# EAGLE design FREENFET (EAGLE 6.5.0)
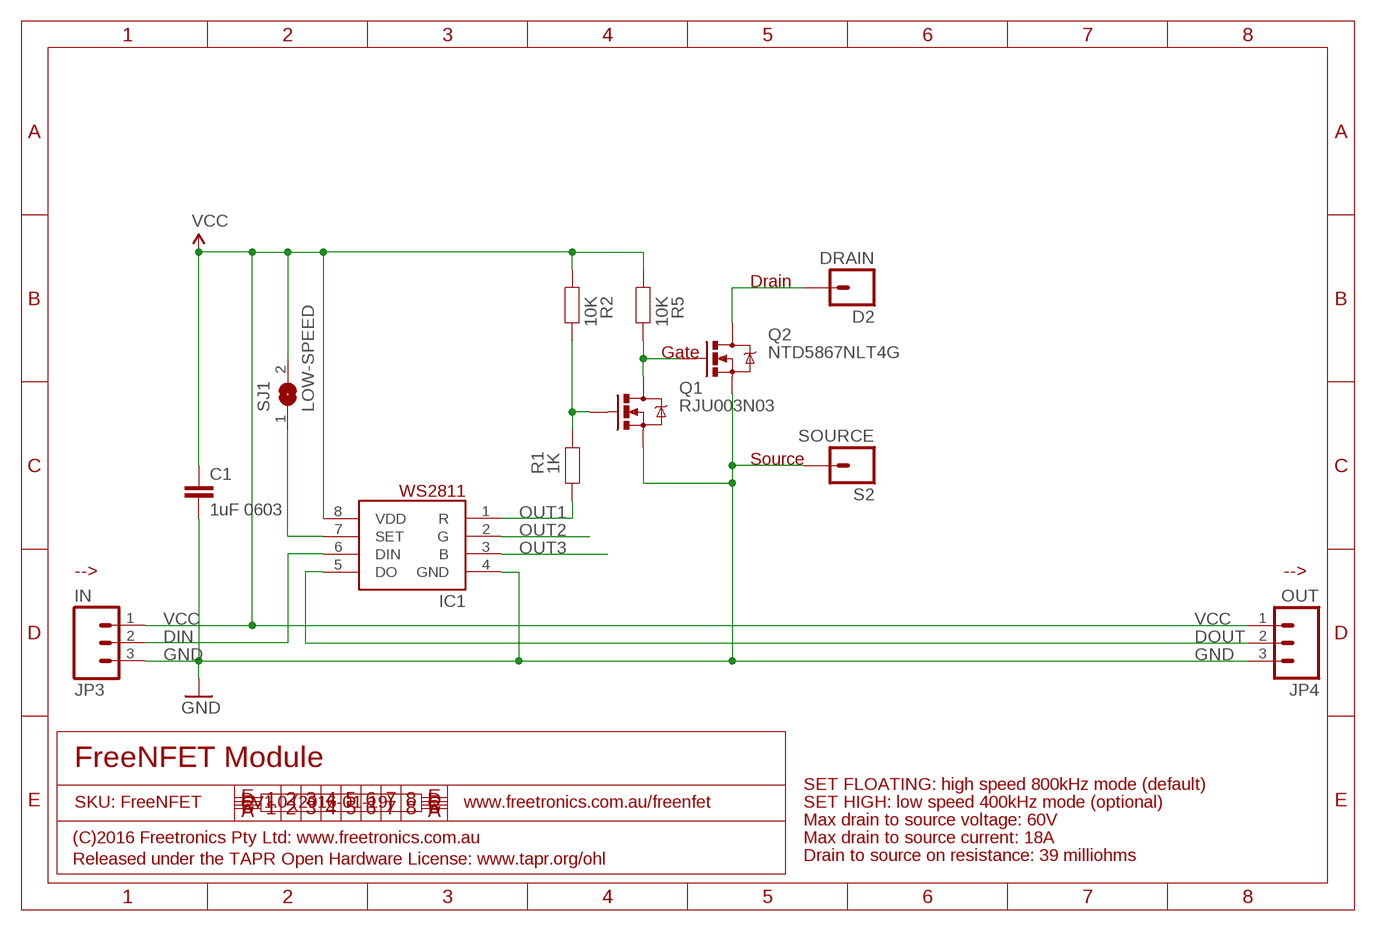
[diagram p0: schematic, sheet 1]

## Parts
C1  1uF 0603  CAP0603  [0603]
D2  DRAIN  M01PTH_LARGE  [1X01LARGE]
IC1  WS2811-SOP8  [SO08-SKINNYPADS]
JP3  IN  M03PTH  [1X03]
JP4  OUT  M03PTH  [1X03]
Q1  RJU003N03  MOSFET-NSOT-323  [SOT32-3]
Q2  NTD5867NLT4G  MOSFET-NCHANNELDPAK  [DPACK]
R1  1K  RESISTOR0603  [0603]
R2  10K  RESISTOR0603  [0603]
R5  10K  RESISTOR0603  [0603]
S2  SOURCE  M01PTH_LARGE  [1X01LARGE]
SJ1  LOW-SPEED  SJN  [SJ]

## Nets
D: D2.1 Q2.2(D)
DIN: IC1.6(DIN) JP3.2
DOUT: IC1.5(DO) JP4.2
GND: C1.2 IC1.4(GND) JP3.3 JP4.3 Q1.2(S) Q2.3(S) S2.1
N$1: IC1.7(SET) SJ1.1
N$2: Q1.1(G) R1.1 R2.1
N$3: Q1.3(D) Q2.1(G) R5.1
OUT1: IC1.1(R) R1.2
OUT2: IC1.2(G)
OUT3: IC1.3(B)
VCC: C1.1 IC1.8(VDD) JP3.1 JP4.1 R2.2 R5.2 SJ1.2

## Notes on the sheet
- Drain
- Gate
- Source
- --> | -->
- FreeNFET Module
- SET FLOATING: high speed 800kHz mode (default)
- SKU: FreeNFET | V1.0 (2016-01-19) | www.freetronics.com.au/freenfet | SET HIGH: low speed 400kHz mode (optional)
- Max drain to source voltage: 60V
- (C)2016 Freetronics Pty Ltd: www.freetronics.com.au | Max drain to source current: 18A
- Released under the TAPR Open Hardware License: www.tapr.org/ohl | Drain to source on resistance: 39 milliohms

## Library data of the parts
C1 = freetronics-master-v1:CAP: Capacitor Standard 0603 ceramic capacitor, and 0.1" leaded capacitor.
D2 S2 = freetronics-master-v1.1:M01: Header 1 Standard 1-pin 0.1" header. Use with straight break away headers (SKU : PRT-00116), right angle break away headers (PRT-00553), swiss pins (PRT-00743), machine pins (PRT-00117), and female headers (PRT-00115).
IC1 = freetronics-jon:WS2811
JP3 JP4 = freetronics-jon:M03: Header 3 Standard 3-pin 0.1" header. Use with straight break away headers (SKU : PRT-00116), right angle break away headers (PRT-00553), swiss pins (PRT-00743), machine pins (PRT-00117), and female headers (PRT-00115). Molex polarized connector foot print use with SKU : PRT-08232 with associated crimp pins and housings.
Q1 = freetronics-jon:MOSFET-N: Basic N-Channel MOSFET
Q2 = freetronics-master-v1.1:MOSFET-NCHANNEL
R1 R2 R5 = freetronics-master-v1:RESISTOR: Resistor Basic schematic elements and footprints for 0603, 1206, and PTH 1/10th watt (small) resistors.
SJ1 = freetronics-jon:SJ: SMD solder JUMPER

## Board
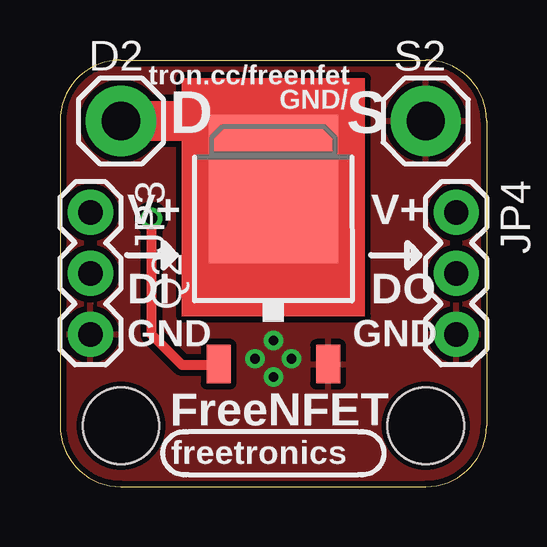
[diagram p1: board, top side]
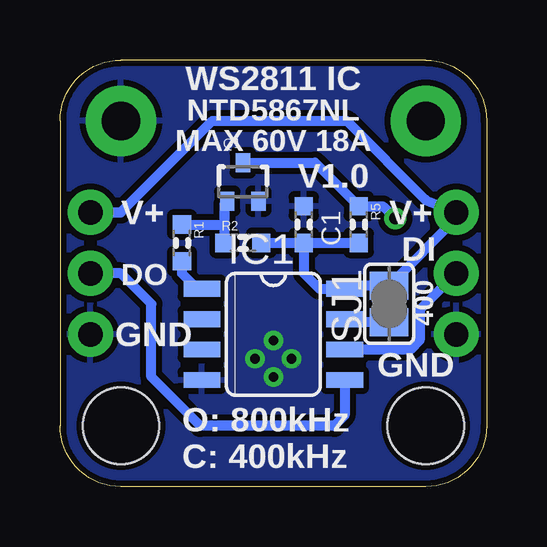
[diagram p2: board, bottom side, seen from below]

Size 17.78 x 17.78 mm. Coordinates in mm from the lower left corner, seen from the top.
Outline: 0,2.54 arc90 2.54,0 15.24,0 arc90 17.78,2.54 17.78,15.24 arc90 15.24,17.78 2.54,17.78 arc90 0,15.24 0,2.54
Copper layers (1*16): Top 0.035mm / dielectric 1.5mm / Bottom 0.035mm
Design rules "default *": minimum track width 8mil, minimum drill 15mil, track to track 10mil, track to pad 10mil, pad to pad 10mil, via to via 10mil, smd to smd 8mil, copper to edge 10mil, drill to drill 8mil, minimum pad ring 14mil, minimum via ring 8mil, stop-mask expansion 4mil, vias tented up to drill 25mil, thermal gap 10mil
Holes 3.17 mm at 2.54,2.54 15.24,2.54

### Footprints (pad centres in the part's own frame; a part is rotated, then mirrored left to right if it is on the bottom)
0603 = smd 0.762 x 0.762: 1 -0.762,0; 2 0.762,0
1X01LARGE = drill 1.6 pad 2.921: 1 0,0
SO08-SKINNYPADS = smd 0.66 x 1.524: 1 -1.905,-2.973; 2 -0.635,-2.973; 3 0.635,-2.973; 4 1.905,-2.973; 5 1.905,2.973; 6 0.635,2.973; 7 -0.635,2.973; 8 -1.905,2.973
1X03 = drill 1.016 pad 1.88: 1 0,0; 2 2.54,0; 3 5.08,0
SOT32-3 = smd 0.6 x 0.8: 1 -0.65,-0.8; 2 0.65,-0.8; 3 0,0.8
DPACK = smd 1 x 1.6: 1 -2.28,-4.8; 3 2.28,-4.8 | smd 5.4 x 6.2: 2 0,2.5
SJ = smd 1.168 x 1.6: 1 -0.762,0; 2 0.762,0

### Placement (x,y rotation side)
C1  7.62,10.92 90 bottom
D2  2.54,15.24 0 top
IC1  8.89,6.35 270 bottom
JP3  1.27,11.43 270 top
JP4  16.51,11.43 270 top
Q1  10.16,12.7 0 bottom
Q2  8.89,9.91 0 top
R1  12.7,10.16 270 bottom
R2  10.16,10.16 0 bottom
R5  5.33,10.92 270 bottom
S2  15.24,15.24 0 top
SJ1  4.06,7.62 90 bottom

### Tracks (layer width: path | path; a pad name or v marks a point on that pad's centre or on a via)
D
  Top 0.305: 10.16,15.24 8.89,11.43 Q2.2
  Top 1.676: D2.1 10.16,15.24
DIN
  Bottom 0.406: JP3.2 2.79,7.37 2.79,6.1 3.17,5.71 IC1.6
DOUT
  Bottom 0.406: IC1.5 5.92,2.97 6.35,2.54 11.94,2.54 13.97,4.57 13.97,7.62 15.24,8.89 JP4.2
GND  (via drill 0.4)
  other vias: 8.89,4.57 9.65,5.33 8.13,5.33 8.89,6.1
  pour Top: 0,15.24 arc-90 2.54,17.78 15.24,17.78 arc-90 17.78,15.24 17.78,2.54 arc-90 15.24,0 2.54,0 arc-90 0,2.54
  pour Bottom: 0,15.24 arc-90 2.54,17.78 15.24,17.78 arc-90 17.78,15.24 17.78,2.54 arc-90 15.24,0 2.54,0 arc-90 0,2.54
N$1
  Bottom 0.406: SJ1.1 5.92,6.86 IC1.7
N$2
  Bottom 0.406: R2.1 10.92,10.92 | 10.92,10.92 10.92,11.79 Q1.1 | R1.1 10.92,10.92
N$3  (via drill 0.5)
  Top 0.406: v3.81,11.18 3.81,6.35 5.08,5.08 6.61,5.08 Q2.1
  Bottom 0.406: Q1.3 7.15,13.5 R5.1 4.32,11.68 v3.81,11.18
OUT1
  Bottom 0.406: R1.2 12.7,8.89 12.06,8.26 IC1.1
VCC
  Bottom 0.406: JP4.1 15.24,11.43 11.43,15.24 5.84,15.24 2.54,11.94 JP3.1 1.27,11.18 SJ1.2 5.92,8.38 IC1.8 | IC1.8 5.71,8.26 | R2.2 C1.1 | C1.1 R5.2 | C1.1 7.62,8.89 6.99,8.26 IC1.8
(copper drawn outside any net)
  shapes: Top area x1

### Text on the board
tPlace: tron.cc/freenfet | GND/ | D | S | V+ | V+ | DI | DO | GND | GND | FreeNFET | freetronics
bPlace: WS2811 IC | NTD5867NL | MAX 60V 18A | V1.0 | V+ | V+ | 400 | DI | DO | GND | GND | O: 800kHz / C: 400kHz